# Altium schematic sheet power.SchDoc
size A
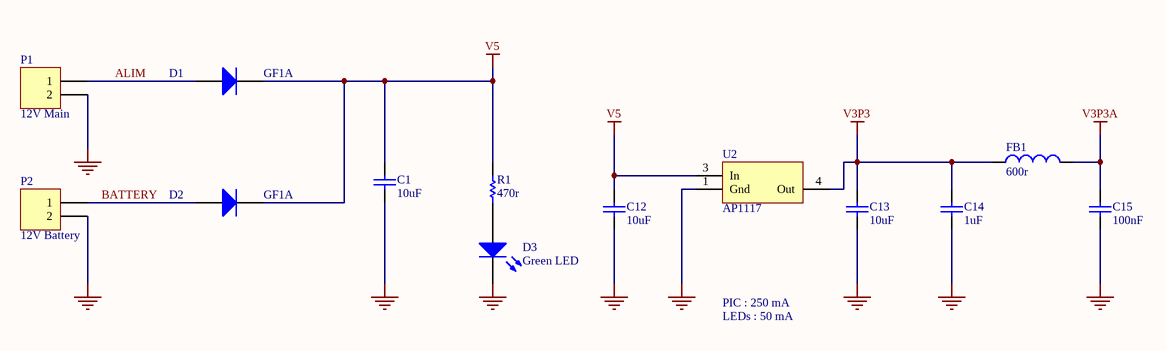
[diagram p0: power.SchDoc]

## Parts
C1  10uF  [CAPC2012N]
C12  10uF  [CAPC2012N]
C13  10uF  [CAPC2012N]
C14  1uF  [CAPC1608N]
C15  100nF  [CAPC1608N]
D1  GF1A  [SMA/DO-214AC_21]
D2  GF1A  [SMA/DO-214AC_21]
D3  Green LED  [LED 0805]
FB1  600r  [INDC1608AN]
P1  12V Main  [PHOENIX_1985195]
P2  12V Battery  [PHOENIX_1985195]
R1  470r  [RESC1608N]
U2  AP1117  [TD03B_N]

## Nets
GND: C1.1 C12.1 C13.1 C14.1 C15.1 D3.2(K) P1.2 P2.2 U2.1(Gnd)
V3P3: C13.2 C14.2 FB1.1 U2.4(Out)
V3P3A: C15.2 FB1.2
V5: C1.2 C12.2 D1.2(K) D2.2(K) R1.2 U2.3(In)
ALIM: D1.1(A) P1.1
BATTERY: D2.1(A) P2.1
NetD3_1: D3.1(A) R1.1

## Notes on the sheet
- PIC : 250 mA
- LEDs : 50 mA

## Library data of the parts
C1 C12 = Cap: Capacitor; Fabricant: TDK; Fournisseur: Farnell; RefFabricant: C2012X5R0J106M/1.25; RefFournisseur: 2309029; Precision: 6,3V X5R; Published: 8-Jun-2000; LatestRevisionDate: 17-Jul-2002; LatestRevisionNote: Re-released for DXP Platform.; PackageReference: RAD-0.3; Publisher: Altium Limited; PackageDescription: Radial Cap, Thru-Hole; 2 Leads; 0.3 in Pin Spacing; Value: 10uF
C13 C14 = Cap: Capacitor; Precision: 6,3V X5R; Published: 8-Jun-2000; LatestRevisionDate: 17-Jul-2002; LatestRevisionNote: Re-released for DXP Platform.; PackageReference: RAD-0.3; Publisher: Altium Limited; PackageDescription: Radial Cap, Thru-Hole; 2 Leads; 0.3 in Pin Spacing
  C13: Value: 10uF
  C14: Value: 1uF
C15 = Cap: Capacitor; Precision: 50V X5R; Published: 8-Jun-2000; LatestRevisionDate: 17-Jul-2002; LatestRevisionNote: Re-released for DXP Platform.; PackageReference: RAD-0.3; Publisher: Altium Limited; PackageDescription: Radial Cap, Thru-Hole; 2 Leads; 0.3 in Pin Spacing; Value: 100nF
D1 D2 = Diode: Default Diode; Fabricant: VISHAY; Fournisseur: Farnell; RefFabricant: GF1A-E3/67A; RefFournisseur: 9549560; Published: 8-Jun-2000; LatestRevisionDate: 17-Jul-2002; LatestRevisionNote: Re-released for DXP Platform.; PackageVersion: Sep-1996; PackageReference: SMC; Publisher: Altium Limited; PackageDescription: DO-214-AB/SMC; 2 C-Bend Leads; Body 7.9 x 5.9 mm, inc. leads (LxW); Code_JEDEC: DO-214-AB
D3 = LED2: Typical RED, GREEN, YELLOW, AMBER GaAs LED; Fabricant: KINGBRIGHT; Fournisseur: Farnell; RefFabricant: KPT-2012SGC; RefFournisseur: 2099239; Published: 8-Jun-2000; LatestRevisionDate: 17-Jul-2002; LatestRevisionNote: Re-released for DXP Platform.; PackageVersion: Feb-2002; PackageReference: 3.2X1.6X1.1; Publisher: Altium Limited; PackageDescription: SM LED; 2 Flat Leads
FB1 = Inductor: Code_IEC: 1005; Value: 600; Fabricant: Wurth; Fournisseur: Farnell; RefFabricant: 742792651; RefFournisseur: 1635706; Published: 8-Jun-2000; LatestRevisionDate: 29-May-2009; LatestRevisionNote: IPC-7351 Footprint Added.; PackageReference: 0402-A; Publisher: Altium Limited; PackageDescription: Chip Inductor; Code_JEITA: 0402
P1 P2 = Header 2: Header, 2-Pin; Fabricant: PHOENIX CONTACT; Fournisseur: Farnell; RefFabricant: PTSA 1.5/2-3,5-Z; RefFournisseur: 1792769; LatestRevisionDate: 17-Jul-2002; LatestRevisionNote: Re-released for DXP Platform.; Publisher: Altium Limited
R1 = Res1: Resistor; Published: 8-Jun-2000; LatestRevisionDate: 17-Jul-2002; LatestRevisionNote: Re-released for DXP Platform.; PackageReference: AXIAL-0.3; Publisher: Altium Limited; PackageDescription: Axial Device, Thru-Hole; 2 Leads; 0.3 in Pin Spacing; Value: 470r
U2 = AP1117: 1A LDO, 18V input, DPAK; Fabricant: DIODES INC; Fournisseur: Farnell; RefFabricant: AP1117D33G-13; RefFournisseur: 1825285